# EAGLE design PSoC4_Prototyping_Kit_DCO (EAGLE 7.2.0)
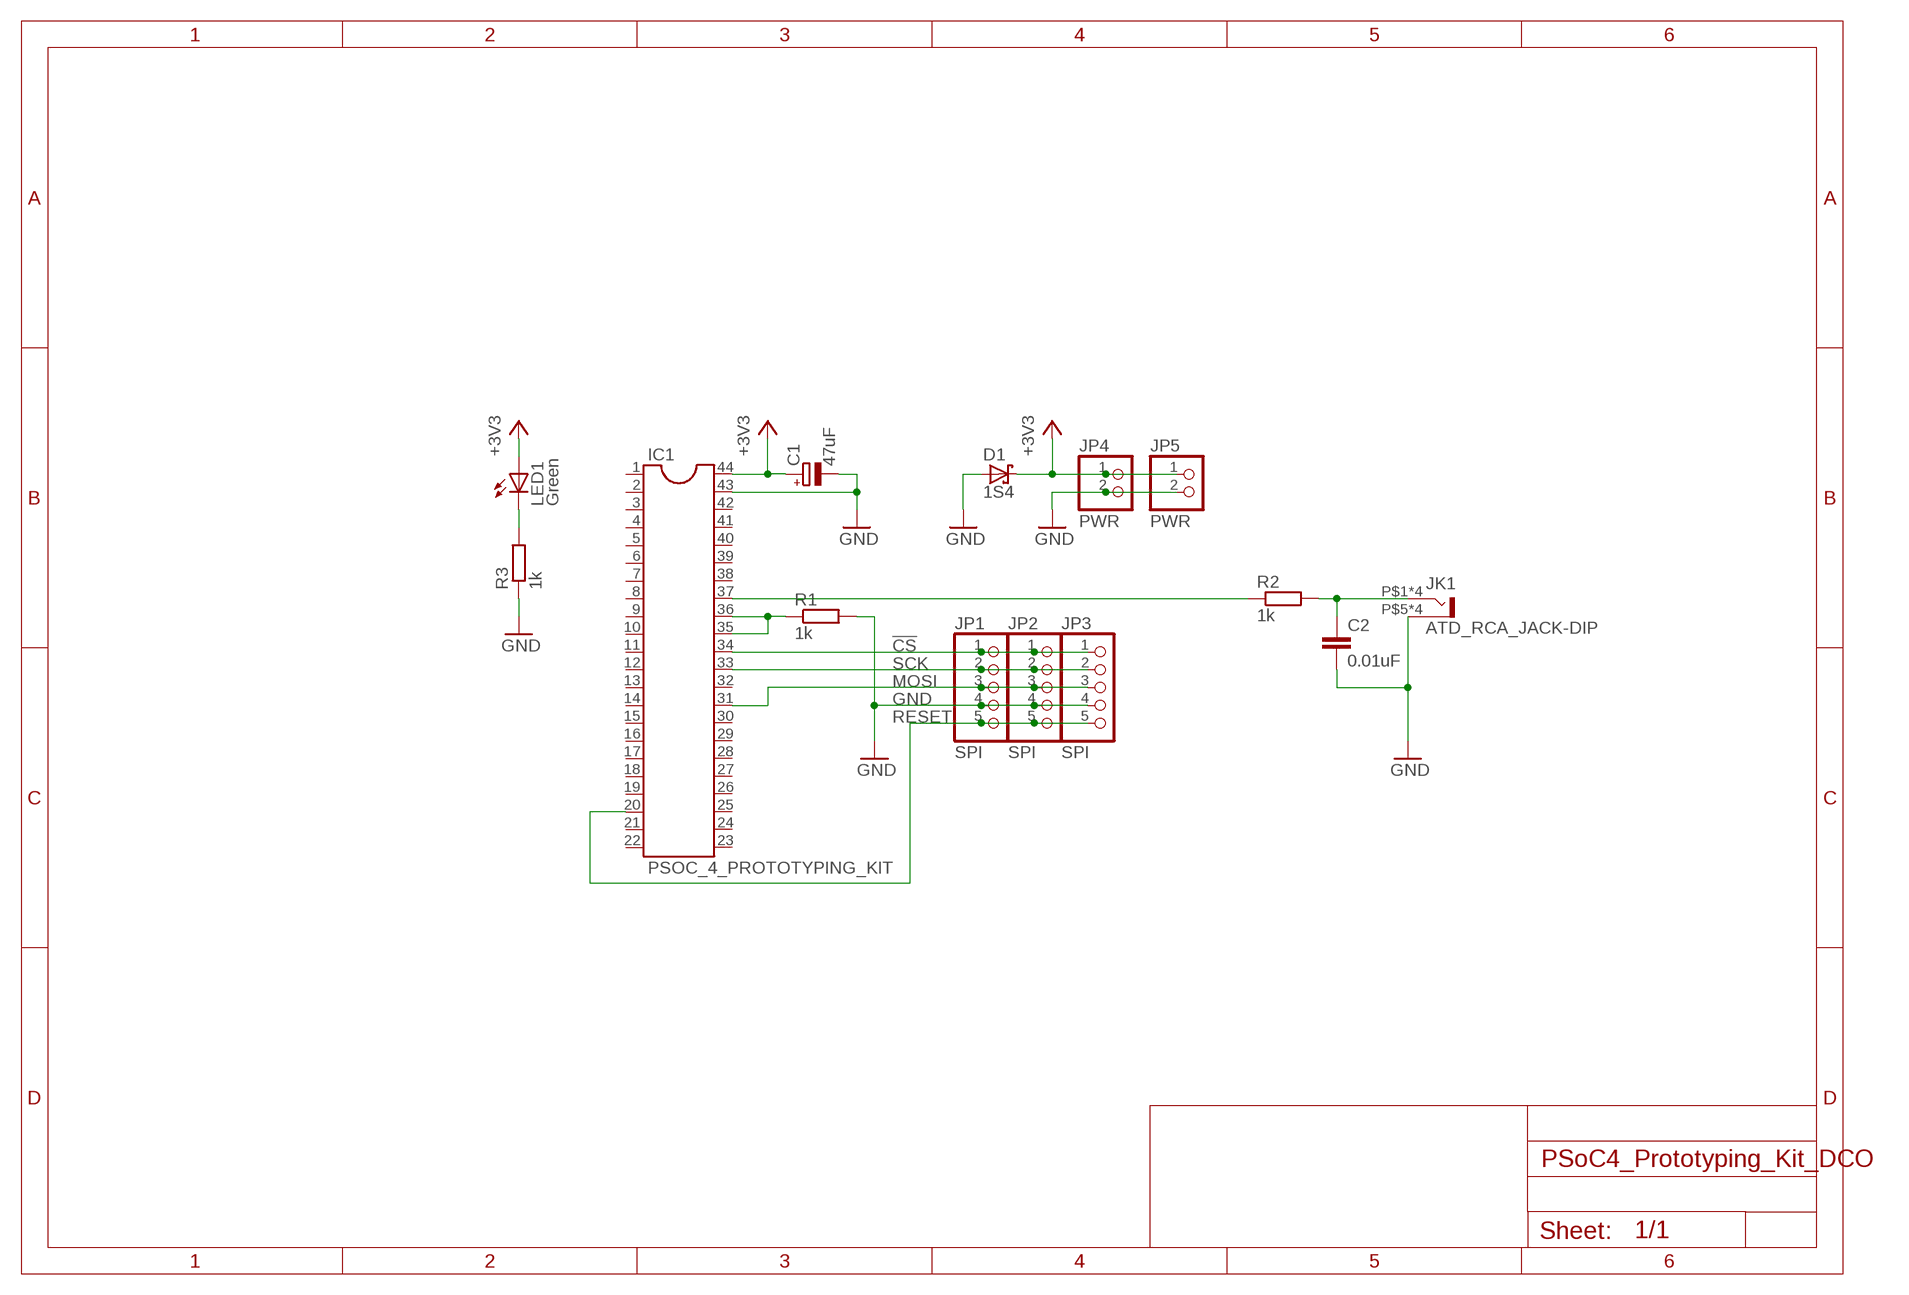
[diagram p0: schematic, sheet 1]

## Parts
C1  47uF  CPOL-EUE2.5-5  [E2,5-5]
C2  0.01uF  C-EU050-024X044  [C050-024X044]
D1  1S4  SCHOTTKY-DIODEDO35-7  [DO35-7]
IC1  PSOC_4_PROTOTYPING_KIT  PSOC_PROTOTYPING_KIT  [DIL44-8]
JK1  ATD_RCA_JACK-DIP  [ATD_RCA_JACK_DIP]
JP1  SPI  PINHD-1X5  [1X05]
JP2  SPI  PINHD-1X5  [1X05]
JP3  SPI  PINHD-1X5  [1X05]
JP4  PWR  PINHD-1X2  [1X02]
JP5  PWR  PINHD-1X2  [1X02]
LED1  Green  LED3MM  [LED3MM]
R1  1k  R-EU_0207/7  [0207/7]
R2  1k  R-EU_0207/7  [0207/7]
R3  1k  R-EU_0207/7  [0207/7]

## Nets
!CS: IC1.34 JP1.1 JP2.1 JP3.1
+3V3: C1.+ D1.C IC1.44 JP4.1 JP5.1 LED1.A
GND: C1.- C2.2 D1.A IC1.43 JK1.P$5(S) JK1.P$6(S) JK1.P$7(S) JK1.P$8(S) JP1.4 JP2.4 JP3.4 JP4.2 JP5.2 R1.2 R3.1
MOSI: IC1.31 JP1.3 JP2.3 JP3.3
N$1: IC1.35 IC1.36 R1.1
N$2: LED1.K(C) R3.2
N$5: IC1.37 R2.1
N$6: C2.1 JK1.P$1(T) JK1.P$2(T) JK1.P$3(T) JK1.P$4(T) R2.2
RESET: IC1.20 JP1.5 JP2.5 JP3.5
SCK: IC1.33 JP1.2 JP2.2 JP3.2
Unconnected: IC1.1 IC1.2 IC1.3 IC1.4 IC1.5 IC1.6 IC1.7 IC1.8 IC1.9 IC1.10 IC1.11 IC1.12 IC1.13 IC1.14 IC1.15 IC1.16 IC1.17 IC1.18 IC1.19 IC1.21 IC1.22 IC1.23 IC1.24 IC1.25 IC1.26 IC1.27 IC1.28 IC1.29 IC1.30 IC1.32 IC1.38 IC1.39 IC1.40 IC1.41 IC1.42

## Library data of the parts
C1 = rcl:CPOL-EU: POLARIZED CAPACITOR, European symbol
C2 = rcl:C-EU: CAPACITOR, European symbol
D1 = diode:SCHOTTKY-DIODE: Schottky Diode
IC1 = mylib2:PSOC_PROTOTYPING_KIT: Cypress PSoC 4 Prototyping Kit
JK1 = mylib2:ATD_RCA_JACK-DIP
JP1-JP3 = pinhead:PINHD-1X5: PIN HEADER
JP4 JP5 = pinhead:PINHD-1X2: PIN HEADER
LED1 = led:LED: LED OSRAM: - CHIPLED LG R971, LG N971, LY N971, LG Q971, LY Q971, LO R971, LY R971 LH N974, LH R974 LS Q976, LO Q976, LY Q976 LO Q996 - Hyper CHIPLED LW Q18S LB Q993, LB Q99A, LB R99A - SideLED LS A670, LO A670, LY A670, LG A670, LP A670 LB A673, LV A673, LT A673, LW A673 LH A674 LY A675 LS A676, LA A676, LO A676, LY A676, LW A676 LS A679, LY A679, LG A679 - Hyper Micro SIDELED® LS Y876, LA Y876, LO Y876, LY Y876 LT Y87S - SmartLED LW L88C, LW L88S LB L89C, LB L89S, LG L890 LS L89K, LO L89K, LY L89K LS L896, LA L896, LO L896, LY L896 - TOPLED LS T670, LO T670, LY T670, LG T670, LP T670 LSG T670, LSP T670, LSY T670, LOP T670, LYG T670 LG T671, LOG T671, LSG T671 LB T673, LV T673, LT T673, LW T673 LH T674 LS T676, LA T676, LO T676, LY T676, LB T676, LH T676, LSB T676, LW T676 LB T67C, LV T67C, LT T67C, LS T67K, LO T67K, LY T67K, LW E67C LS E67B, LA E67B, LO E67B, LY E67B, LB E67C, LV E67C, LT E67C LW T67C LS T679, LY T679, LG T679 LS T770, LO T770, LY T770, LG T770, LP T770 LB T773, LV T773, LT T773, LW T773 LH T774 LS E675, LA E675, LY E675, LS T675 LS T776, LA T776, LO T776, LY T776, LB T776 LHGB T686 LT T68C, LB T68C - Hyper Mini TOPLED® LB M676 - Mini TOPLED Santana® LG M470 LS M47K, LO M47K, LY M47K Source: http://www.osram.convergy.de LUXEON: - LUMILED® LXK2-PW12-R00, LXK2-PW12-S00, LXK2-PW14-U00, LXK2-PW14-V00 LXK2-PM12-R00, LXK2-PM12-S00, LXK2-PM14-U00 LXK2-PE12-Q00, LXK2-PE12-R00, LXK2-PE12-S00, LXK2-PE14-T00, LXK2-PE14-U00 LXK2-PB12-K00, LXK2-PB12-L00, LXK2-PB12-M00, LXK2-PB14-N00, LXK2-PB14-P00, LXK2-PB14-Q00 LXK2-PR12-L00, LXK2-PR12-M00, LXK2-PR14-Q00, LXK2-PR14-R00 LXK2-PD12-Q00, LXK2-PD12-R00, LXK2-PD12-S00 LXK2-PH12-R00, LXK2-PH12-S00 LXK2-PL12-P00, LXK2-PL12-Q00, LXK2-PL12-R00 Source: www.luxeon.com KINGBRIGHT: KA-3528ASYC Source: www.kingbright.com
R1-R3 = rcl:R-EU_: RESISTOR, European symbol

## Board
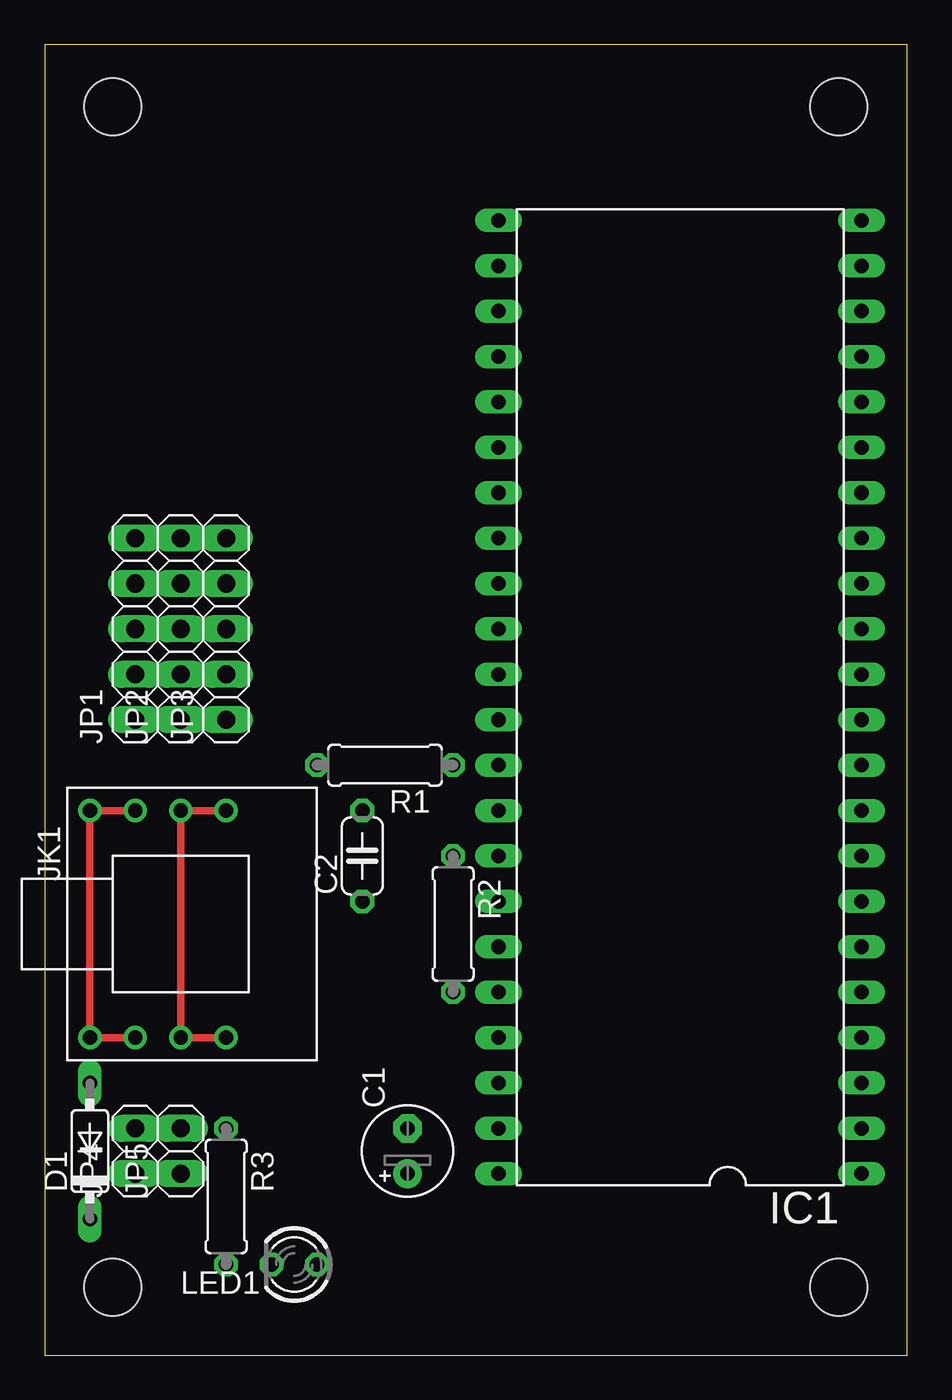
[diagram p1: board, top side]
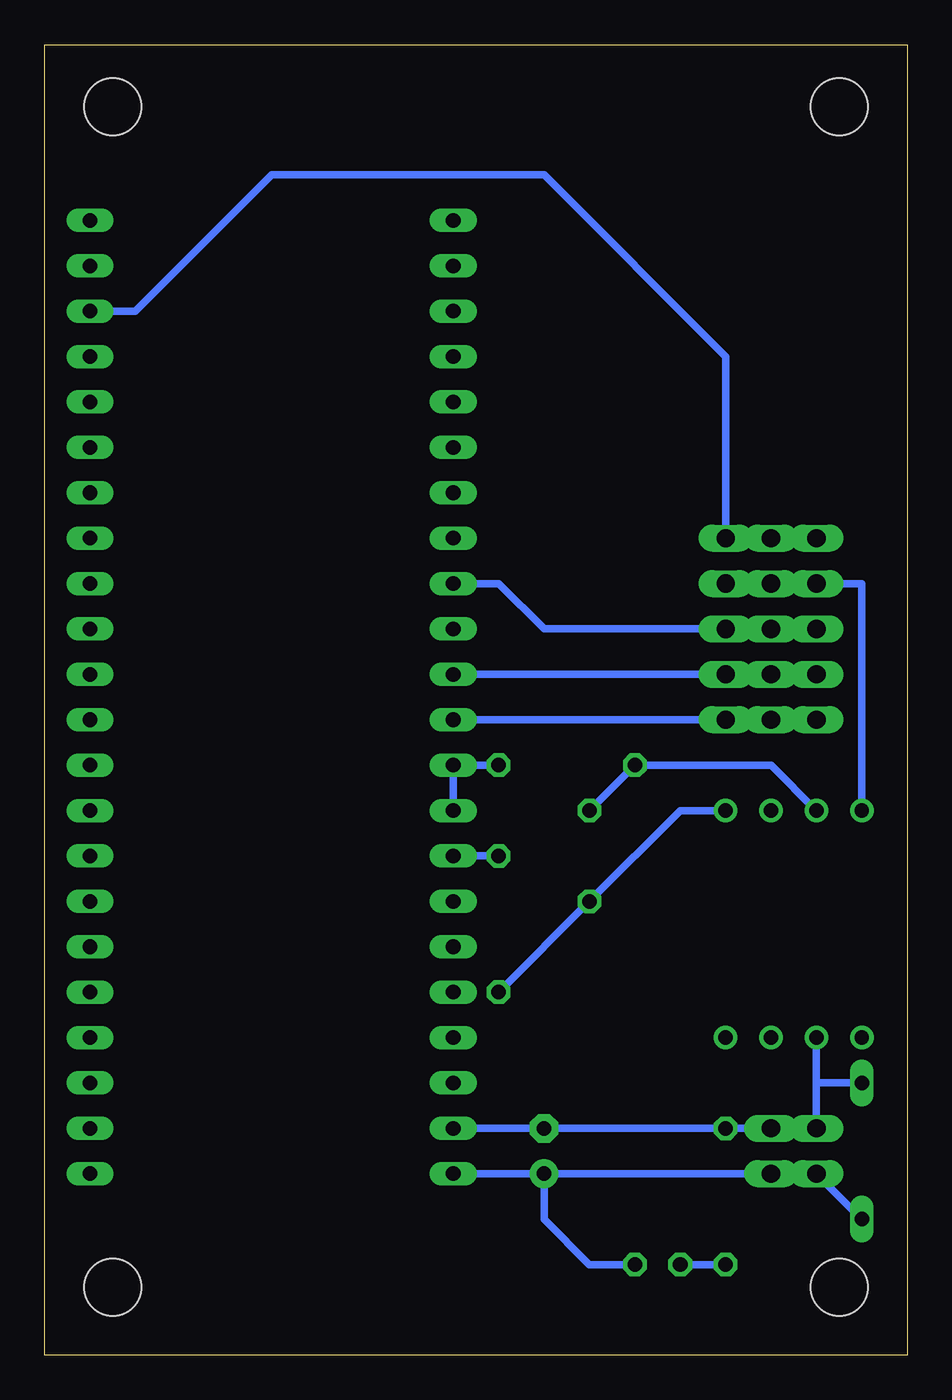
[diagram p2: board, bottom side, seen from below]

Size 48.25 x 73.33 mm. Coordinates in mm from the lower left corner, seen from the top.
Outline: 48.25,0 48.25,73.33 0,73.33 0,0 48.25,0
Copper layers (1*16): Top 0.035mm / dielectric 1.5mm / Bottom 0.035mm
Design rules "default": minimum track width 10mil, minimum drill 24mil, track to track 8mil, track to pad 8mil, pad to pad 8mil, via to via 8mil, smd to smd 8mil, copper to edge 40mil, drill to drill 8mil, minimum pad ring 10mil, minimum via ring 8mil, stop-mask expansion 4mil, vias tented up to drill 0mil, thermal gap 10mil
Holes 3.2 mm at 3.8,3.81 44.44,3.81 44.44,69.85 3.8,69.85

### Footprints (pad centres in the part's own frame; a part is rotated, then mirrored left to right if it is on the bottom)
E2,5-5 = drill 0.813 pad 1.6: + -1.27,0 | drill 0.813 pad 1.6 octagon: - 1.27,0
C050-024X044 = drill 0.813 octagon: 1 -2.54,0; 2 2.54,0
DO35-7 = drill 0.813 long: A 3.81,0; C -3.81,0
DIL44-8 = drill 0.813 long: 1 -26.67,-7.62; 2 -24.13,-7.62; 3 -21.59,-7.62; 4 -19.05,-7.62; 5 -16.51,-7.62; 6 -13.97,-7.62; 7 -11.43,-7.62; 8 -8.89,-7.62; 9 -6.35,-7.62; 10 -3.81,-7.62; 11 -1.27,-7.62; 12 1.27,-7.62; 13 3.81,-7.62; 14 6.35,-7.62; 15 8.89,-7.62; 16 11.43,-7.62; 17 13.97,-7.62; 18 16.51,-7.62; 19 19.05,-7.62; 20 21.59,-7.62; 21 24.13,-7.62; 22 26.67,-7.62; 23 26.67,12.7; 24 24.13,12.7; 25 21.59,12.7; 26 19.05,12.7; 27 16.51,12.7; 28 13.97,12.7; 29 11.43,12.7; 30 8.89,12.7; 31 6.35,12.7; 32 3.81,12.7; 33 1.27,12.7; 34 -1.27,12.7; 35 -3.81,12.7; 36 -6.35,12.7; 37 -8.89,12.7; 38 -11.43,12.7; 39 -13.97,12.7; 40 -16.51,12.7; 41 -19.05,12.7; 42 -21.59,12.7; 43 -24.13,12.7; 44 -26.67,12.7
ATD_RCA_JACK_DIP = drill 0.8: P$1 2.54,6.35; P$2 0,6.35; P$3 2.54,-6.35; P$4 0,-6.35; P$5 -2.54,6.35; P$6 -5.08,6.35; P$7 -2.54,-6.35; P$8 -5.08,-6.35
1X05 = drill 1.016 long: 1 -5.08,0; 2 -2.54,0; 3 0,0; 4 2.54,0; 5 5.08,0
1X02 = drill 1.016 long: 1 -1.27,0; 2 1.27,0
LED3MM = drill 0.813 octagon: A -1.27,0; K 1.27,0
0207/7 = drill 0.813 octagon: 1 -3.81,0; 2 3.81,0

### Placement (x,y rotation side)
C1  20.31,11.43 90 top
C2  17.77,27.94 90 top
D1  2.53,11.43 90 top
IC1  38.09,36.83 90 top
JK1  7.61,24.13 0 top
JP1  5.07,40.64 90 top
JP2  7.61,40.64 90 top
JP3  10.15,40.64 90 top
JP4  5.07,11.43 90 top
JP5  7.61,11.43 90 top
LED1  13.96,5.08 180 top
R1  19.04,33.02 180 top
R2  22.85,24.13 270 top
R3  10.15,8.89 270 top

### Tracks (layer width: path | path; a pad name or v marks a point on that pad's centre or on a via)
!CS
  Bottom 0.406: IC1.34 JP3.1 JP2.1 JP1.1
+3V3
  Bottom 0.406: C1.+ IC1.44 | C1.+ JP5.1 JP4.1 D1.C | LED1.A 17.77,5.08 20.31,7.62 C1.+
GND
  Top 0.406: JK1.P$5 JK1.P$6 JK1.P$8 JK1.P$7
  Bottom 0.406: JK1.P$5 7.61,33.02 R1.2 C2.2 | IC1.43 C1.- R3.1 JP5.2 JP4.2 5.07,15.24 | 5.07,15.24 JK1.P$7 | JK1.P$6 2.53,43.18 JP1.4 JP2.4 JP3.4 | D1.A 5.07,15.24
MOSI
  Bottom 0.406: IC1.31 22.85,43.18 20.31,40.64 JP3.3 JP2.3 JP1.3
N$1
  Bottom 0.406: R1.1 IC1.35 IC1.36
N$2
  Bottom 0.406: R3.2 LED1.K
N$5
  Bottom 0.406: IC1.37 R2.1
N$6
  Top 0.406: JK1.P$1 JK1.P$2 JK1.P$4 JK1.P$3
  Bottom 0.406: JK1.P$1 12.69,30.48 C2.1 R2.2
RESET
  Bottom 0.406: JP1.5 JP2.5 JP3.5 10.15,55.88 20.31,66.04 35.55,66.04 43.17,58.42 IC1.20
SCK
  Bottom 0.406: JP1.2 JP2.2 JP3.2 IC1.33